# EAGLE design Wildly_4Lipo_Charge (EAGLE 9.3.2)
AUTHOR: K. TOWNSEND
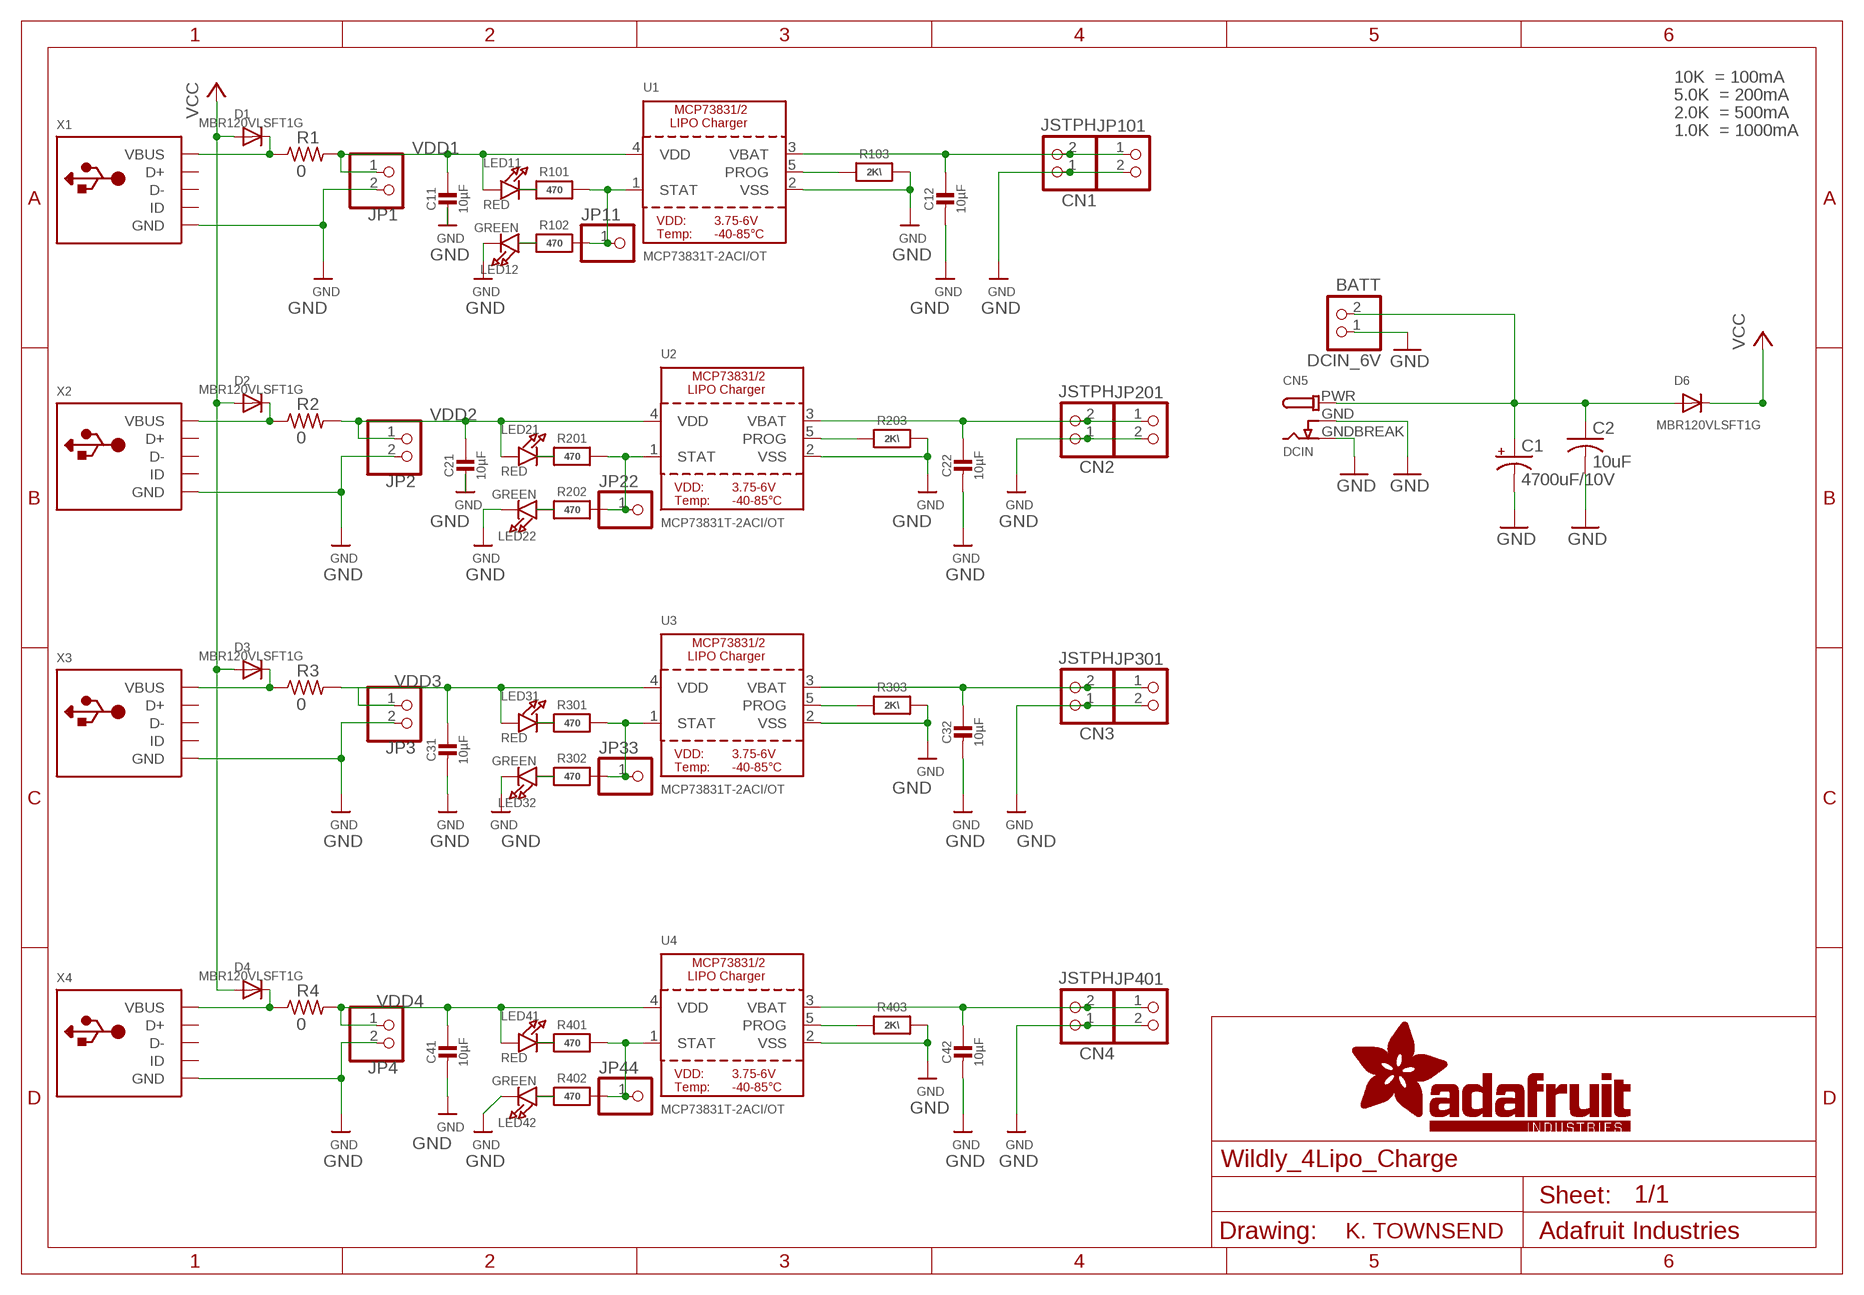
[diagram p0: schematic, sheet 1]

## Parts
C1  4700uF/10V  CPOL-USE5-13  [E5-13]
C2  10uF  C-USC0805K  [C0805K]
C11  10µF  CAP_CERAMIC0805-NOOUTLINE  [0805-NO]
C12  10µF  CAP_CERAMIC0805-NOOUTLINE  [0805-NO]
C21  10µF  CAP_CERAMIC0805-NOOUTLINE  [0805-NO]
C22  10µF  CAP_CERAMIC0805-NOOUTLINE  [0805-NO]
C31  10µF  CAP_CERAMIC0805-NOOUTLINE  [0805-NO]
C32  10µF  CAP_CERAMIC0805-NOOUTLINE  [0805-NO]
C41  10µF  CAP_CERAMIC0805-NOOUTLINE  [0805-NO]
C42  10µF  CAP_CERAMIC0805-NOOUTLINE  [0805-NO]
CN1  JSTPH  JST_2PIN  [JSTPH2]
CN2  JSTPH  JST_2PIN  [JSTPH2]
CN3  JSTPH  JST_2PIN  [JSTPH2]
CN4  JSTPH  JST_2PIN  [JSTPH2]
CN5  DCIN  DCBARRELSMT  [DCJACK_2MM_SMT]
D1  MBR120VLSFT1G  DIODESOD-123  [SOD-123]
D2  MBR120VLSFT1G  DIODESOD-123  [SOD-123]
D3  MBR120VLSFT1G  DIODESOD-123  [SOD-123]
D4  MBR120VLSFT1G  DIODESOD-123  [SOD-123]
D6  MBR120VLSFT1G  DIODESOD-123  [SOD-123]
DCIN_6V  BATT  HEADER-1X2ROUND  [1X02_ROUND]
JP1  HEADER-1X2ROUND  [1X02_ROUND]
JP2  HEADER-1X2ROUND  [1X02_ROUND]
JP3  HEADER-1X2ROUND  [1X02_ROUND]
JP4  HEADER-1X2ROUND  [1X02_ROUND]
JP11  PINHD-1X1CB  [1X01-CLEANBIG]
JP22  PINHD-1X1CB  [1X01-CLEANBIG]
JP33  PINHD-1X1CB  [1X01-CLEANBIG]
JP44  PINHD-1X1CB  [1X01-CLEANBIG]
JP101  HEADER-1X2ROUND  [1X02_ROUND]
JP201  HEADER-1X2ROUND  [1X02_ROUND]
JP301  HEADER-1X2ROUND  [1X02_ROUND]
JP401  HEADER-1X2ROUND  [1X02_ROUND]
LED11  RED  LED0805_NOOUTLINE  [CHIPLED_0805_NOOUTLINE]
LED12  GREEN  LED0805_NOOUTLINE  [CHIPLED_0805_NOOUTLINE]
LED21  RED  LED0805_NOOUTLINE  [CHIPLED_0805_NOOUTLINE]
LED22  GREEN  LED0805_NOOUTLINE  [CHIPLED_0805_NOOUTLINE]
LED31  RED  LED0805_NOOUTLINE  [CHIPLED_0805_NOOUTLINE]
LED32  GREEN  LED0805_NOOUTLINE  [CHIPLED_0805_NOOUTLINE]
LED41  RED  LED0805_NOOUTLINE  [CHIPLED_0805_NOOUTLINE]
LED42  GREEN  LED0805_NOOUTLINE  [CHIPLED_0805_NOOUTLINE]
R1  0  R-US_R0805  [R0805]
R2  0  R-US_R0805  [R0805]
R3  0  R-US_R0805  [R0805]
R4  0  R-US_R0805  [R0805]
R101  470  RESISTOR0805_NOOUTLINE  [0805-NO]
R102  470  RESISTOR0805_NOOUTLINE  [0805-NO]
R103  2K\  RESISTOR0805_NOOUTLINE  [0805-NO]
R201  470  RESISTOR0805_NOOUTLINE  [0805-NO]
R202  470  RESISTOR0805_NOOUTLINE  [0805-NO]
R203  2K\  RESISTOR0805_NOOUTLINE  [0805-NO]
R301  470  RESISTOR0805_NOOUTLINE  [0805-NO]
R302  470  RESISTOR0805_NOOUTLINE  [0805-NO]
R303  2K\  RESISTOR0805_NOOUTLINE  [0805-NO]
R401  470  RESISTOR0805_NOOUTLINE  [0805-NO]
R402  470  RESISTOR0805_NOOUTLINE  [0805-NO]
R403  2K\  RESISTOR0805_NOOUTLINE  [0805-NO]
U1  MCP73831T-2ACI/OT  MCP73831/2  [SOT23-5]
U2  MCP73831T-2ACI/OT  MCP73831/2  [SOT23-5]
U3  MCP73831T-2ACI/OT  MCP73831/2  [SOT23-5]
U4  MCP73831T-2ACI/OT  MCP73831/2  [SOT23-5]
X1  USB_MEDIUM  [USB-MINI_MEDIUM]
X2  USB_MEDIUM  [USB-MINI_MEDIUM]
X3  USB_MEDIUM  [USB-MINI_MEDIUM]
X4  USB_MEDIUM  [USB-MINI_MEDIUM]

## Nets
GND: C1.- C2.2 C11.2 C12.2 C21.2 C22.2 C31.2 C32.2 C41.2 C42.2 CN1.1 CN2.1 CN3.1 CN4.1 CN5.GND(GNDBREAK) CN5.GNDBREAK(GND) DCIN_6V.1 JP1.2 JP2.2 JP3.2 JP4.2 JP101.2 JP201.2 JP301.2 JP401.2 LED12.C LED22.C LED32.C LED42.C R103.2 R203.2 R303.2 R403.2 U1.2(VSS) U2.2(VSS) U3.2(VSS) U4.2(VSS) X1.GND X1.GND1(GND) X1.GND2(GND) X1.GND3(GND) X1.GND4(GND) X2.GND X2.GND1(GND) X2.GND2(GND) X2.GND3(GND) X2.GND4(GND) X3.GND X3.GND1(GND) X3.GND2(GND) X3.GND3(GND) X3.GND4(GND) X4.GND X4.GND1(GND) X4.GND2(GND) X4.GND3(GND) X4.GND4(GND)
N$1: LED21.C R201.1
N$2: JP22.1 R201.2 R202.2 U2.1(STAT)
N$4: LED11.C R101.1
N$5: R203.1 U2.5(PROG)
N$6: LED22.A R202.1
N$7: JP11.1 R101.2 R102.2 U1.1(STAT)
N$8: R103.1 U1.5(PROG)
N$9: LED12.A R102.1
N$10: D3.C R3.1 X3.VBUS
N$11: LED31.C R301.1
N$12: JP33.1 R301.2 R302.2 U3.1(STAT)
N$13: R303.1 U3.5(PROG)
N$14: LED32.A R302.1
N$16: LED41.C R401.1
N$17: JP44.1 R401.2 R402.2 U4.1(STAT)
N$18: R403.1 U4.5(PROG)
N$19: LED42.A R402.1
N$21: C1.+ C2.1 CN5.PWR D6.A DCIN_6V.2
N$25: D2.C R2.1 X2.VBUS
N$26: D1.C R1.1 X1.VBUS
N$27: D4.C R4.1 X4.VBUS
VBAT: C22.1 CN2.2 JP201.1 U2.3(VBAT)
VBAT1: C12.1 CN1.2 JP101.1 U1.3(VBAT)
VBAT2: C32.1 CN3.2 JP301.1 U3.3(VBAT)
VBAT3: C42.1 CN4.2 JP401.1 U4.3(VBAT)
VCC: D1.A D2.A D3.A D4.A D6.C
VDD1: C11.1 JP1.1 LED11.A R1.2 U1.4(VDD)
VDD2: C21.1 JP2.1 LED21.A R2.2 U2.4(VDD)
VDD3: C31.1 JP3.1 LED31.A R3.2 U3.4(VDD)
VDD4: C41.1 JP4.1 LED41.A R4.2 U4.4(VDD)
Unconnected: X1.D+ X1.D- X1.ID X2.D+ X2.D- X2.ID X3.D+ X3.D- X3.ID X4.D+ X4.D- X4.ID

## Notes on the sheet
- 10K  = 100mA
- 5.0K  = 200mA
- 2.0K  = 500mA
- 1.0K  = 1000mA

## Library data of the parts
C1 = adafruit:CPOL-US: POLARIZED CAPACITOR, American symbol
C2 = adafruit:C-US: CAPACITOR, American symbol
C11 C12 C21 C22 C31 C32 C41 C42 = microbuilder:CAP_CERAMIC: Ceramic Capacitors For new designs, use the packages preceded by an '_' character since they are more reliable: The following footprints should be used on most boards: _0402 - Standard footprint for regular board layouts _0603 - Standard footprint for regular board layouts _0805 - Standard footprint for regular board layouts _1206 - Standard footprint for regular board layouts For extremely tight-pitch boards where space is at a premium, the following 'micro-pitch' footprints can be used (smaller pads, no silkscreen outline, etc.): _0402MP - Micro-pitch footprint for very dense/compact boards _0603MP - Micro-pitch footprint for very dense/compact boards _0805MP - Micro-pitch footprint for very dense/compact boards _1206MP - Micro-pitch footprint for very dense/compact boards
CN1-CN4 = microbuilder:JST_2PIN: JST 2-Pin Right-Angle Connector PH-Series - 4UConnector: 17311 SH-Series - 4UConnector: 07278
CN5 = microbuilder:DCBARREL: DC Barrel Jack DCJACK_1.3MM_PTH - Through Hole 1.3mm Jack (4UConnector: 05536) DCJACK_2MM_PTH - Through Hole 2.0/2.1 Jack (4UConnector: 05537) DCJACK_2MM_SMT - SMT 2.0/2.1mm Jack(4UConnector: 03267)
D1-D4 D6 = microbuilder:DIODE: Diode SMA Model Volts Amps Type Vf Vr Digikey # Notes SSA34-E3 40V 3A Schottky 480mV @ 3A 200uA @ 40V SSA34-E3/61TGITR-ND CDBA120-G 20V 1A Schottky 500mV @ 1A 500uA @ 20V 641-1014-6-ND REEL MBRA210 10V 2A Schottky 350mV @ 2A 700uA @ 10V MBRA210LT3 SOD-123 Model Volts Amps Type Vf Vr Order # Notes BAT54T1G 30V 200mA Schottky 800mV @ 200mA 2uA @ 25V BAT54T1GOSTR-ND B0530W 30V 500mA Schottky 430mV @ 500mA 130uA @ 30V B0530W-FDICT-ND REEL MBR120 20V 1A Schottky 340mV @ 1A MBR120VLSFT1GOSCT-ND SOD-323 Model Volts Amps Type Vf Vr Order # Notes PMEG2005EJ 20V 500mA Schottky 355mV @ 500mA 568-4110-1-ND ZLLS410 10V 570mA Schottky 380mV @ 570mA ZLLS410CT-ND 1N4148WS 75V 150mA Silicon/Simple 1V 1N4148WSFSCT-ND REEL SOD-523 Model Volts Amps Type Vf Vr Order # Notes BAT54XV2 30V 200mA Schottky 0.8V @ 100mA BAT54XV2CT-ND TB751S 30V 30mA Schottky RB751S-40TE61CT-ND SOT23-R/W (R = Solder Paste/Reflow Ovens, W = Hand-Soldering) Model Volts Amps Type Vf Vr Order # Notes BAT54FILM 40V 300mA Schottky 497-7162-1-ND
DCIN_6V JP1-JP4 JP101 JP201 JP301 JP401 = microbuilder:HEADER-1X2: PIN HEADER
JP11 JP22 JP33 JP44 = adafruit:PINHD-1X1: Pin header 1x1 for 0.1" spacing With round pins
LED11 LED12 LED21 LED22 LED31 LED32 LED41 LED42 = microbuilder:LED: LED 0603 - 0603 Surface Mount Package 2mA: Green LED - Low Power (3.9mcd, 2ma, 1.7Vf) - Digikey: 475-2709-2-ND Orange LED - Low Power (9.8mcd, 2ma, 1.8Vf) - Digikey: 475-1194-2-ND Red LED - Low Power (5mcd, 2ma, 1.8Vf) - Digikey: 475-1195-2-ND Yellow LED - Low Power (7mcd, 2ma, 1.8Vf) - Digikey: 475-1196-2-ND 5mA: Blue LED - Low Power (17mcd, 5ma, 2.9Vf) - Digikey: LNJ937W8CRACT-ND 0805 - 0805 Surface Mount Package 2mA: Red LED (8.8mcd, 2mA, 1.8Vf, Clear) - Low Power [Digikey: 475-2510-1-ND] Green LED (5mcd, 2mA, 1.8Vf, Clear) - Low Power [Digikey: 475-2730-1-ND] Yellow LED (11.3mcd, 2mA, 1.8Vf, Clear) - Low Power [Digikey: 475-2555-1-ND] 20mA: Red LED (104mcd, 20mA, Diffused) - LS R976 [Digikey: 475-1278-6-ND] Red LED (12mcd, 20mA, 2.0Vf, Clear) - APT2012EC [Digikey: 754-1128-1-ND] Green LED (15mcd, 20mA, 2.2Vf, Clear) - APT2012GC [Digikey: 754-1131-1-ND] Orange LED (160mcd, 20mA, 2.1Vf, Clear) - APT2012SECK [Digikey: 754-1130-1-ND] 1206 - 1206 Surface Mount Package Green LED (26mcd, 20mA, Diffused) - LG N971 [Digikey: 475-1407-6-ND] Red LED (15mcd, 20mA, Diffused) - LH N974 [Digikey: 475-1416-6-ND] Cree - Cree High-Power Surface Mount LEDs XPEBWT-L1-0000-00D50 - White 111lm 350mA 2.9Vf 6200K 110° XTEAWT-00-0000-00000LEE3 - White 114lm 350mA 2.85Vf 5000K 115° Everlight - Everlight 45-21 Series Surface Mount LEDs 45-21/QK2C-B2832AC2CB2/2T - Warm White 2000mcd 20mA 3.25Vf 3050K 120° 45-21/LK2C-B38452C4CB2/2T - Nuetral White 2000mcd 20mA 3.25Vf 4150K 120° 45-21/LK2C-B50634C6CB2/2T - Cold White 2200mcd 20mA 3.25Vf 5650K 120° PLCC2 Reverse Mount LS T77K-J1L2-1-0-2-R18-Z - Red 11.25mcd 2mA 1.8Vf 630nm 120° LO T77K-L1M2-24-Z - Orange 19.6mcd 2mA 1.8Vf 606nm 120° LY T77K-K2M1-26-Z - Yellow 15.7mcd 2mA 1.8Vf 587nm 120°
R1-R4 = adafruit:R-US_: RESISTOR, American symbol
R101-R103 R201-R203 R301-R303 R401-R403 = microbuilder:RESISTOR: Resistors For new designs, use the packages preceded by an '_' character since they are more reliable: The following footprints should be used on most boards: _0402 - Standard footprint for regular board layouts _0603 - Standard footprint for regular board layouts _0805 - Standard footprint for regular board layouts _1206 - Standard footprint for regular board layouts For extremely tight-pitch boards where space is at a premium, the following 'micro-pitch' footprints can be used (smaller pads, no silkscreen outline, etc.): _0402MP - Micro-pitch footprint for very dense/compact boards _0603MP - Micro-pitch footprint for very dense/compact boards _0805MP - Micro-pitch footprint for very dense/compact boards _1206MP - Micro-pitch footprint for very dense/compact boards
U1-U4 = microbuilder:MCP73831/2: MCP73831/2 LIPO Charger VDD: 3.75 - 6V Temp -40 - 85°C Programmable Charge Rate: 15-500mA NOTE: STAT is a tri-state logic output on the MCP73831 and an open-drain output on the MCP73832. SOT23-5 with 4.2V output and tri-state logic on STAT = MCP73831T-2ACI/OT
X1-X4 = microbuilder:USB: USB Connectors USBMINIB - Surface Mount Female Mini-B USB Connector 4UConnector: 06564

## Board
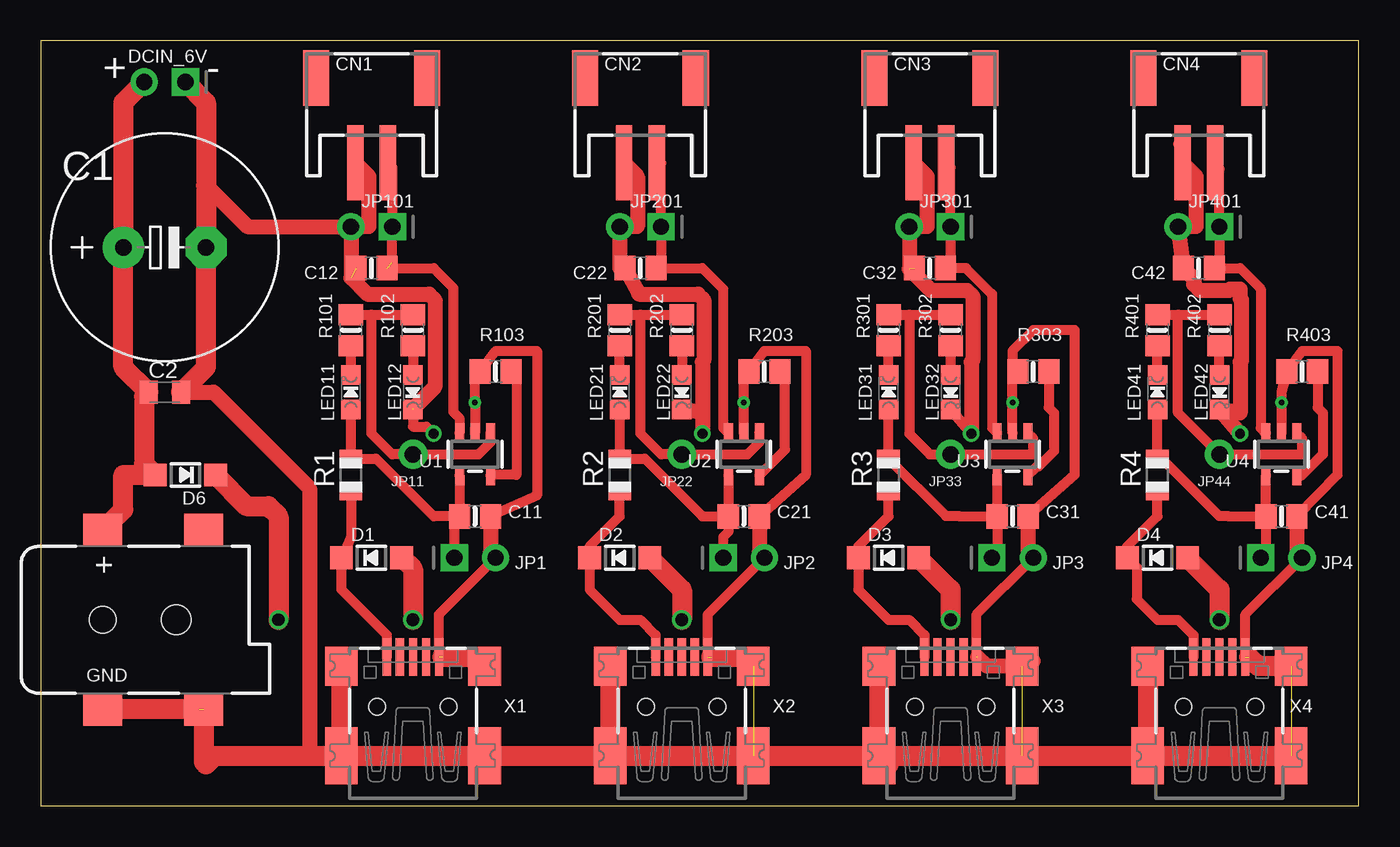
[diagram p1: board, top side]
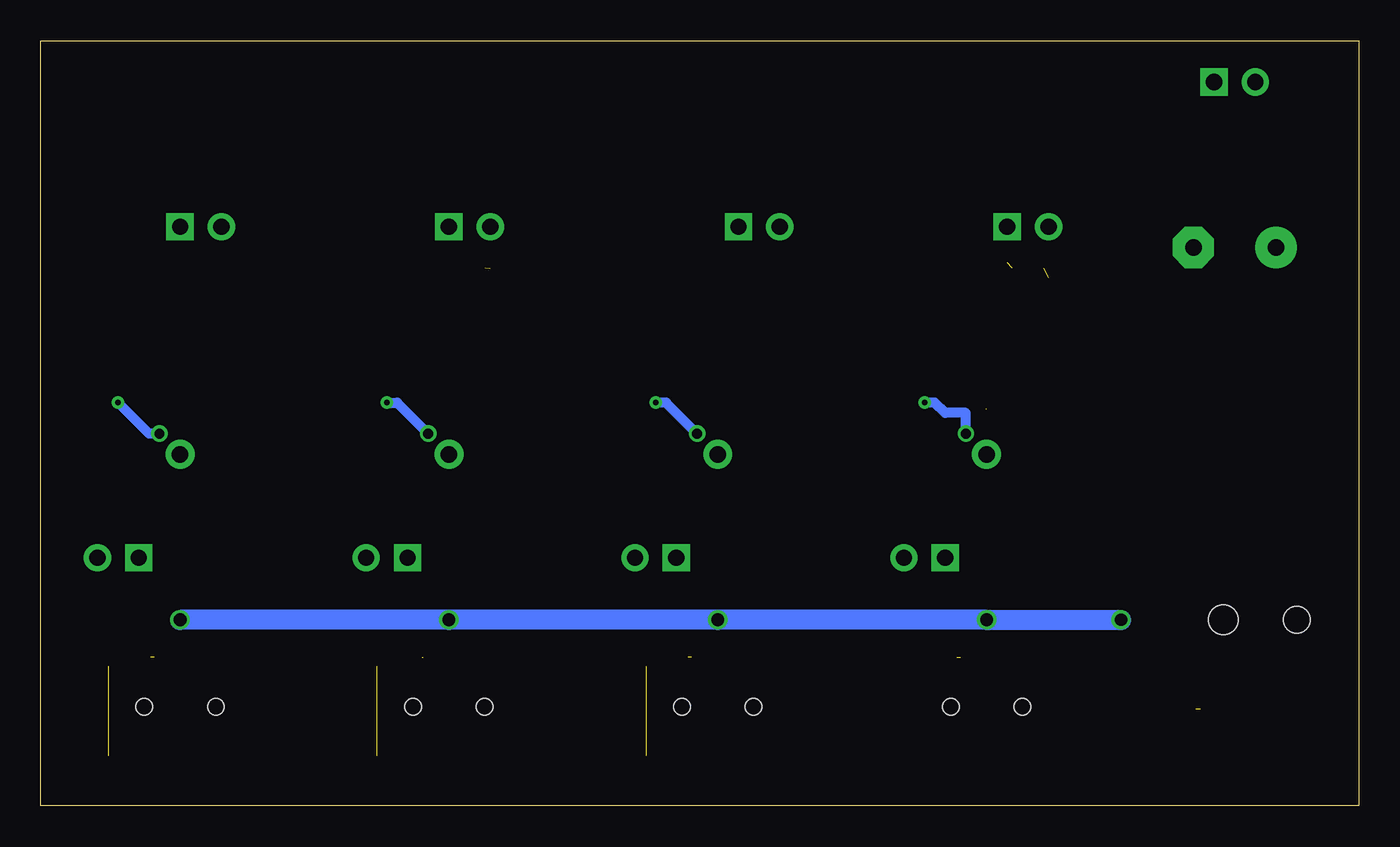
[diagram p2: board, bottom side, seen from below]

Size 80.95 x 46.98 mm. Coordinates in mm from the lower left corner, seen from the top.
Outline: 0,0 80.95,0 80.95,46.98 0,46.98 0,0
Copper layers (1*16): Top 0.035mm / dielectric 1.5mm / Bottom 0.035mm
Design rules "default": minimum track width 6mil, minimum drill 0.35mm, track to track 6mil, track to pad 6mil, pad to pad 6mil, via to via 6mil, smd to smd 6mil, copper to edge 40mil, drill to drill 6mil, minimum pad ring 10mil, minimum via ring 8mil, stop-mask expansion 4mil, vias tented up to drill 0mil, thermal gap 10mil

### Footprints (pad centres in the part's own frame; a part is rotated, then mirrored left to right if it is on the bottom)
E5-13 = drill 1.016 pad 2.54: + -2.54,0 | drill 1.016 pad 2.54 octagon: - 2.54,0
C0805K = smd 1.1 x 1.4: 1 -1,0; 2 1,0
0805-NO = smd 1.3 x 1.5: 1 -0.95,0; 2 0.95,0
JSTPH2 = smd 1 x 4.6: 1 -1,-3.7; 2 1,-3.7 | smd 1.6 x 3.4: NC1 -3.4,1.5; NC2 3.4,1.5
DCJACK_2MM_SMT = smd 2.4 x 2: GND 0,-5.5; GNDBREAK 6.2,-5.5; PWR 0,5.5; PWR2 6.2,5.5 | hole 1.6: 0,0 | hole 1.8: 4.5,0
SOD-123 = smd 1.4 x 1.4: A 1.85,0; C -1.85,0
1X02_ROUND = drill 1 pad 1.676 square: 1 -1.27,0 | drill 1 pad 1.676: 2 1.27,0
1X01-CLEANBIG = drill 1.016 pad 1.778: 1 0,0
CHIPLED_0805_NOOUTLINE = smd 1.2 x 1.2: A 0,-1.05; C 0,1.05
R0805 = smd 1.1 x 1.4: 1 -1,0; 2 1,0
SOT23-5 = smd 0.55 x 1.2: 1 -0.95,-1.3; 2 0,-1.3; 3 0.95,-1.3; 4 0.95,1.3; 5 -0.95,1.3
USB-MINI_MEDIUM = smd 0.5 x 2.308: D+ 0,4.064; D- -0.8,4.064; GND 1.6,4.064; ID 0.8,4.064; VBUS -1.6,4.064 | smd 2 x 3.5: GND1 -4.4,-2; GND4 4.4,-2 | smd 2 x 2.4: GND2 -4.4,3.5; GND3 4.4,3.5 | hole 1: -2.2,1; 2.2,1

### Placement (x,y rotation side)
C1  7.62,34.29 0 top
C2  7.62,25.4 0 top
C11  26.67,17.78 0 top
C12  20.32,33.02 180 top
C21  43.18,17.78 0 top
C22  36.83,33.02 180 top
C31  59.69,17.78 0 top
C32  54.61,33.02 180 top
C41  76.2,17.78 0 top
C42  71.12,33.02 180 top
CN1  20.32,43.18 0 top
CN2  36.83,43.18 0 top
CN3  54.61,43.18 0 top
CN4  71.12,43.18 0 top
CN5  3.81,11.43 0 top
D1  20.32,15.24 0 top
D2  35.56,15.24 0 top
D3  52.07,15.24 0 top
D4  68.58,15.24 0 top
D6  8.89,20.32 180 top
DCIN_6V  7.62,44.45 180 top
JP1  26.67,15.24 0 top
JP2  43.18,15.24 0 top
JP3  59.69,15.24 0 top
JP4  76.2,15.24 0 top
JP11  22.86,21.59 0 top
JP22  39.37,21.59 0 top
JP33  55.88,21.59 0 top
JP44  72.39,21.59 0 top
JP101  20.32,35.56 180 top
JP201  36.83,35.56 180 top
JP301  54.61,35.56 180 top
JP401  71.12,35.56 180 top
LED11  19.05,25.4 0 top
LED12  22.86,25.4 180 top
LED21  35.56,25.4 0 top
LED22  39.37,25.4 180 top
LED31  52.07,25.4 0 top
LED32  55.88,25.4 180 top
LED41  68.58,25.4 0 top
LED42  72.39,25.4 180 top
R1  19.05,20.32 90 top
R2  35.56,20.32 90 top
R3  52.07,20.32 90 top
R4  68.58,20.32 90 top
R101  19.05,29.21 90 top
R102  22.86,29.21 90 top
R103  27.94,26.67 180 top
R201  35.56,29.21 90 top
R202  39.37,29.21 90 top
R203  44.45,26.67 180 top
R301  52.07,29.21 90 top
R302  55.88,29.21 90 top
R303  60.96,26.67 180 top
R401  68.58,29.21 90 top
R402  72.39,29.21 90 top
R403  77.47,26.67 180 top
U1  26.67,21.59 180 top
U2  43.18,21.59 180 top
U3  59.69,21.59 180 top
U4  76.2,21.59 180 top
X1  22.86,5.08 0 top
X2  39.37,5.08 0 top
X3  55.88,5.08 0 top
X4  72.39,5.08 0 top

### Tracks (layer width: path | path; a pad name or v marks a point on that pad's centre or on a via)
GND  (via drill 0.35, 0.6)  (11 unrouted)
  Top 0.61: C11.2 30.48,19.05 30.48,27.94 27.94,27.94 R103.2 26.67,26.67 v26.67,24.77 U1.2 26.67,23.17 | v24.13,22.86 23.7,23.29 22.86,23.29 LED12.C | C21.2 46.99,20.32 46.99,27.94 44.45,27.94 R203.2 43.18,26.35 v43.18,24.77 U2.2 | C31.2 63.5,20.32 63.5,29.21 60.96,29.21 59.69,27.94 59.69,26.67 | 59.69,26.67 R303.2 | LED32.C v57.15,22.86 | C41.2 79.63,20.32 79.63,27.94 77.47,27.94 R403.2 76.2,25.4 v76.2,24.77 U4.2 | 69.85,40.64 70.12,40.37 CN4.1 | X1.GND 24.46,11.76 JP1.2 | X2.GND 40.97,11.76 JP2.2 | X3.GND 57.48,11.76 JP3.2 | X4.GND 73.99,11.76 JP4.2 | U3.2 v59.69,24.77 59.69,26.67
  Top 0.914: CN1.1 20.14,38.66 20.14,35.56 JP101.2 | 22.86,24.39 24.22,25.75 24.22,31.06 23.86,31.42 20.05,31.42 19.05,32.42 JP101.2 | CN2.1 36.65,38.66 36.65,35.56 JP201.2 35.56,33.02 C22.2 36.74,31.42 40.37,31.42 40.73,31.06 40.73,27.36 40.64,27.27 40.64,24.13 | 40.64,24.13 LED22.C | 40.64,24.13 v40.64,22.86 | CN3.1 54.43,38.66 54.43,35.56 JP301.2 53.34,32.98 54.66,31.66 56.9,31.66 57.24,31.32 57.24,27.36 57.15,27.27 v57.15,22.86 | 60.96,8.89 X3.GND3 58.1,8.58 57.54,9.14 | CN4.1 70.94,38.66 70.94,35.56 JP401.2 C42.2 70.81,32.38 70.81,32.02 71.17,31.66 72.97,31.66 73.05,31.74 73.65,31.74 73.65,31.16 73.75,31.06 73.75,27.36 73.66,27.27 73.66,24.13 LED42.C v73.66,22.86 | C11.2 27.62,15.56 JP1.2 | C21.2 44.13,15.56 JP2.2 | C31.2 60.64,15.56 JP3.2 | C41.2 77.15,15.56 JP4.2 | C2.2 10.61,25.4 16.51,19.5 16.51,3.08 | 10.16,38.1 12.7,35.56 JP101.2
  Top 1.219: CN5.GND 9.74,5.93 10.16,6.35 | DCIN_6V.1 10.16,43.18 10.16,38.1 C1.- 10.16,26.94 C2.2 | X1.GND2 X1.GND1 | X1.GND3 26.7,9.14 24.67,9.14 | X1.GND1 X1.GND4 X2.GND1 | X2.GND2 X2.GND1 | X2.GND1 X2.GND4 51.53,3.08 52.07,2.54 52.07,3.08 | X2.GND3 43.21,9.14 41.18,9.14 | X3.GND2 X3.GND1 52.07,3.08 | 52.07,3.08 X3.GND4 X4.GND1 | X4.GND2 X4.GND1 | X4.GND1 X4.GND4 | X4.GND3 74.77,8.58 74.2,9.14 | CN5.GNDBREAK 10.01,2.69 10.16,2.54 10.7,3.08 16.51,3.08 X1.GND1
  Bottom 0.61: v24.13,22.86 24.13,24.13 25.4,24.13 26.03,24.77 v26.67,24.77 | v40.64,22.86 42.54,24.77 v43.18,24.77 | v59.69,24.77 59.05,24.77 v57.15,22.86 | v73.66,22.86 74.3,22.86 v76.2,24.77
N$1
  Top 0.61: LED21.C R201.1
N$2
  Top 0.61: U2.1 44.13,22.32 43.4,21.59 JP22.1 38.1,21.59 36.83,22.86 36.83,30.16 | R201.2 36.83,30.16 | 36.83,30.16 R202.2
N$4
  Top 0.61: LED11.C R101.1
N$5
  Top 0.61: U2.5 45.72,21.88 45.72,26.35 R203.1
N$6
  Top 0.61: R202.1 LED22.A
N$7
  Top 0.61: R101.2 20.32,30.16 | 20.32,30.16 R102.2 | 20.32,30.16 20.32,22.86 21.59,21.59 JP11.1 26.89,21.59 27.62,22.32 U1.1
N$8
  Top 0.61: R103.1 29.21,26.35 29.21,20.32 27.65,20.32 U1.5
N$9
  Top 0.61: R102.1 LED12.A
N$10
  Top 0.61: R3.1 52.07,17.78 50.22,15.93 D3.C 50.22,13.28 52.07,11.43 53.34,11.43 54.28,10.49 X3.VBUS
N$11
  Top 0.61: LED31.C R301.1
N$12
  Top 0.61: R301.2 53.34,30.16 | 53.34,30.16 R302.2 | U3.1 60.96,22.57 60.96,21.59 JP33.1 54.61,21.59 53.34,22.86 53.34,30.16
N$13
  Top 0.61: U3.5 61.18,20.83 61.28,20.83 62.23,21.78 62.23,24.13 61.91,24.45 R303.1
N$14
  Top 0.61: R302.1 LED32.A
N$16
  Top 0.61: LED41.C R401.1
N$17
  Top 0.61: U4.1 77.47,22.57 77.47,21.59 JP44.1 69.85,24.13 69.85,30.16 | R401.2 69.85,30.16 | 69.85,30.16 R402.2
N$18
  Top 0.61: U4.5 77.44,20.29 78.74,21.59 78.74,24.13 78.42,24.45 R403.1
N$19
  Top 0.61: LED42.A R402.1
N$21
  Top 1.219: DCIN_6V.2 5.08,43.18 C1.+ 5.08,26.94 C2.1 6.35,25.13 6.35,21.01 D6.A 5.08,20.32 5.08,18.2 CN5.PWR
N$25
  Top 0.61: R2.1 35.56,17.78 33.71,15.93 D2.C 33.71,13.28 35.56,11.43 36.83,11.43 37.77,10.49 X2.VBUS
N$26
  Top 0.61: R1.1 19.05,16.52 D1.C 18.47,13.28 21.26,10.49 X1.VBUS
N$27
  Top 0.61: X4.VBUS 70.79,10.49 69.85,11.43 68.58,11.43 67.31,12.7 67.31,14.66 D4.C 66.73,15.93 68.58,17.78 R4.1
VBAT
  Top 0.61: U2.3 41.91,23.21 41.91,31.75 40.64,33.02 C22.1 38.1,33.34 JP201.1 38.1,39.48 CN2.2
VBAT1  (1 unrouted)
  Top 0.61: U1.3 25.72,23.81 25.34,24.19 25.34,31.81 24.13,33.02 C12.1 | 21.59,33.34 JP101.1 21.59,39.21 CN1.2
VBAT2
  Top 0.61: U3.3 58.42,23.21 58.42,31.43 56.83,33.02 C32.1 55.88,33.34 JP301.1 55.88,39.21 CN3.2
VBAT3
  Top 0.61: U4.3 74.93,23.21 74.93,31.75 73.66,33.02 72.39,33.02 | C42.1 72.39,33.02 | CN4.2 72.07,39.43 72.39,39.11 JP401.1 72.39,33.02
VCC  (via drill 0.76, 0.78)
  Top 1.219: D1.A 22.86,14.55 v22.86,11.43 | D2.A 39.37,13.28 v39.37,11.43 | D3.A 55.88,13.28 v55.88,11.43 | D4.A 72.39,13.28 v72.39,11.43 | D6.C 12.65,18.41 13.97,18.41 14.6,17.78 v14.6,11.43
  Bottom 1.219: v72.39,11.43 v55.88,11.43 v39.37,11.43 v22.86,11.43 v14.6,11.43
VDD1
  Top 0.61: U1.4 C11.1 | LED11.A R1.2 20.59,21.32 24.13,17.78 C11.1 | C11.1 25.4,17.46 JP1.1
VDD2
  Top 0.61: LED21.A R2.2 37.1,21.32 40.64,17.78 C21.1 | U2.4 C21.1 | C21.1 42.23,16.83 41.91,16.51 JP2.1
VDD3
  Top 0.61: C31.1 U3.4 | LED31.A R3.2 55.59,17.8 56.42,17.8 56.44,17.78 C31.1 | C31.1 58.74,15.56 JP3.1
VDD4
  Top 0.61: C41.1 U4.4 | LED41.A R4.2 68.85,21.32 72.37,17.8 72.93,17.8 72.95,17.78 C41.1 | C41.1 75.25,15.56 JP4.1

### Text on the board
tPlace: + | -